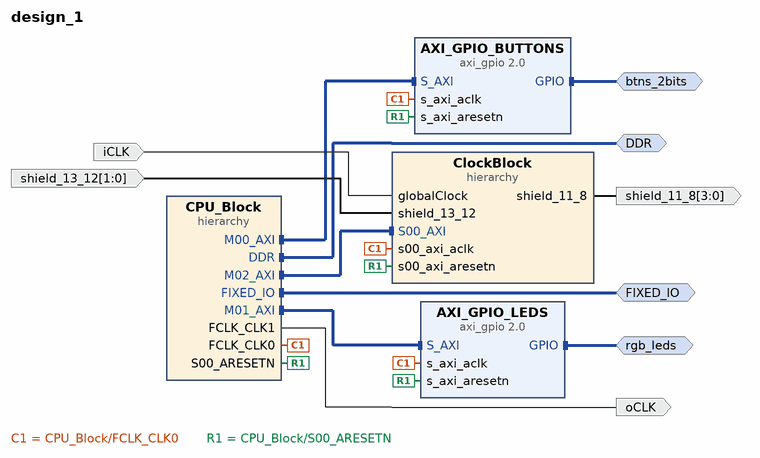
[diagram p0: block diagram of the top level]
# Vivado block design design_1, xc7z007sclg400-1, Vivado 2023.2
create_bd_design design_1

create_bd_intf_port -mode Master -vlnv xilinx.com:interface:ddrx_rtl:1.0 DDR
create_bd_intf_port -mode Master -vlnv xilinx.com:display_processing_system7:fixedio_rtl:1.0 FIXED_IO
create_bd_intf_port -mode Master -vlnv xilinx.com:interface:gpio_rtl:1.0 rgb_leds
create_bd_intf_port -mode Master -vlnv xilinx.com:interface:gpio_rtl:1.0 btns_2bits
create_bd_port -dir O -from 3 -to 0 shield_11_8
create_bd_port -dir I -from 1 -to 0 -type data shield_13_12
create_bd_port -dir I -type clk iCLK
set_property -dict {CONFIG.FREQ_HZ 100000000} [get_bd_ports iCLK]
create_bd_port -dir O -type clk oCLK

create_bd_cell -type ip -vlnv xilinx.com:ip:axi_gpio:2.0 AXI_GPIO_LEDS
set_property -dict {CONFIG.GPIO_BOARD_INTERFACE rgb_leds CONFIG.USE_BOARD_FLOW true} [get_bd_cells AXI_GPIO_LEDS]
create_bd_cell -type ip -vlnv xilinx.com:ip:axi_gpio:2.0 AXI_GPIO_BUTTONS
set_property -dict [list \
  CONFIG.C_INTERRUPT_PRESENT 1 \
  CONFIG.GPIO_BOARD_INTERFACE btns_2bits \
  CONFIG.USE_BOARD_FLOW true \
] [get_bd_cells AXI_GPIO_BUTTONS]
create_bd_cell -type hier ClockBlock
create_bd_cell -type hier CPU_Block

# ---- hierarchy /ClockBlock ----
current_bd_instance /ClockBlock
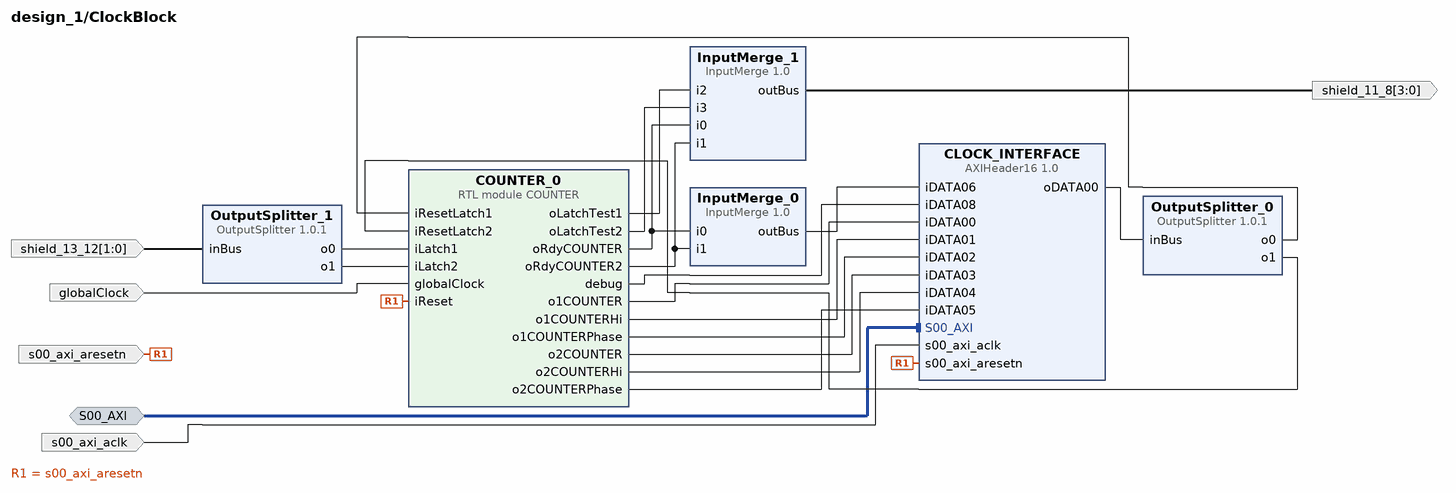
[diagram p1: block diagram inside /ClockBlock]
create_bd_intf_pin -mode Slave -vlnv xilinx.com:interface:aximm_rtl:1.0 S00_AXI
create_bd_pin -dir O -from 3 -to 0 shield_11_8
create_bd_pin -dir I -type clk s00_axi_aclk
create_bd_pin -dir I -type rst s00_axi_aresetn
create_bd_pin -dir I globalClock
create_bd_pin -dir I -from 1 -to 0 shield_13_12

create_bd_cell -type ip -vlnv d3x0r:user:AXIHeader16:1.0 CLOCK_INTERFACE
set_property -dict {CONFIG.INPUTS 9 CONFIG.OUTPUTS 1} [get_bd_cells CLOCK_INTERFACE]
create_bd_cell -type ip -vlnv d3x0r:user:OutputSplitter:1.0.1 OutputSplitter_1
set_property -dict {CONFIG.inWidth 2} [get_bd_cells OutputSplitter_1]
create_bd_cell -type ip -vlnv d3x0r:user:InputMerge:1.0 InputMerge_0
set_property -dict [list \
  CONFIG.inWidth4 0 \
  CONFIG.inWidth5 0 \
  CONFIG.inWidth6 0 \
  CONFIG.inWidth7 0 \
  CONFIG.inWidth8 0 \
  CONFIG.inWidth9 0 \
  CONFIG.inWidth10 0 \
  CONFIG.inWidth11 0 \
  CONFIG.inWidth12 0 \
  CONFIG.inWidth13 0 \
  CONFIG.inWidth14 0 \
  CONFIG.inWidth15 0 \
  CONFIG.inWidth16 0 \
  CONFIG.inWidth17 0 \
  CONFIG.inWidth18 0 \
  CONFIG.inWidth19 0 \
  CONFIG.inWidth20 0 \
  CONFIG.inWidth21 0 \
  CONFIG.inWidth22 0 \
  CONFIG.inWidth23 0 \
  CONFIG.inWidth24 0 \
  CONFIG.inWidth25 0 \
  CONFIG.inWidth26 0 \
  CONFIG.inWidth27 0 \
  CONFIG.inWidth28 0 \
  CONFIG.inWidth29 0 \
  CONFIG.inWidth30 0 \
  CONFIG.inWidth31 0 \
] [get_bd_cells InputMerge_0]
create_bd_cell -type module -reference COUNTER COUNTER_0
create_bd_cell -type ip -vlnv d3x0r:user:InputMerge:1.0 InputMerge_1
set_property -dict [list \
  CONFIG.inWidth4 0 \
  CONFIG.inWidth5 0 \
  CONFIG.inWidth6 0 \
  CONFIG.inWidth7 0 \
  CONFIG.inWidth8 0 \
  CONFIG.inWidth9 0 \
  CONFIG.inWidth10 0 \
  CONFIG.inWidth11 0 \
  CONFIG.inWidth12 0 \
  CONFIG.inWidth13 0 \
  CONFIG.inWidth14 0 \
  CONFIG.inWidth15 0 \
  CONFIG.inWidth16 0 \
  CONFIG.inWidth17 0 \
  CONFIG.inWidth18 0 \
  CONFIG.inWidth19 0 \
  CONFIG.inWidth20 0 \
  CONFIG.inWidth21 0 \
  CONFIG.inWidth22 0 \
  CONFIG.inWidth23 0 \
  CONFIG.inWidth24 0 \
  CONFIG.inWidth25 0 \
  CONFIG.inWidth26 0 \
  CONFIG.inWidth27 0 \
  CONFIG.inWidth28 0 \
  CONFIG.inWidth29 0 \
  CONFIG.inWidth30 0 \
  CONFIG.inWidth31 0 \
  CONFIG.outWidth 4 \
] [get_bd_cells InputMerge_1]
create_bd_cell -type ip -vlnv d3x0r:user:OutputSplitter:1.0.1 OutputSplitter_0
set_property -dict [list \
  CONFIG.enable02 false \
  CONFIG.enable03 false \
  CONFIG.enable04 false \
  CONFIG.enable05 false \
  CONFIG.enable06 false \
  CONFIG.enable07 false \
  CONFIG.enable08 false \
  CONFIG.enable09 false \
  CONFIG.enable10 false \
  CONFIG.enable11 false \
  CONFIG.enable12 false \
  CONFIG.enable13 false \
  CONFIG.enable14 false \
  CONFIG.enable15 false \
  CONFIG.enable16 false \
  CONFIG.enable17 false \
  CONFIG.enable18 false \
  CONFIG.enable19 false \
  CONFIG.enable20 false \
  CONFIG.enable21 false \
  CONFIG.enable22 false \
  CONFIG.enable23 false \
  CONFIG.enable24 false \
  CONFIG.enable25 false \
  CONFIG.enable26 false \
  CONFIG.enable27 false \
  CONFIG.enable28 false \
  CONFIG.enable29 false \
  CONFIG.enable30 false \
  CONFIG.enable31 false \
  CONFIG.inWidth 32 \
] [get_bd_cells OutputSplitter_0]

# ---- hierarchy /CPU_Block ----
current_bd_instance /CPU_Block
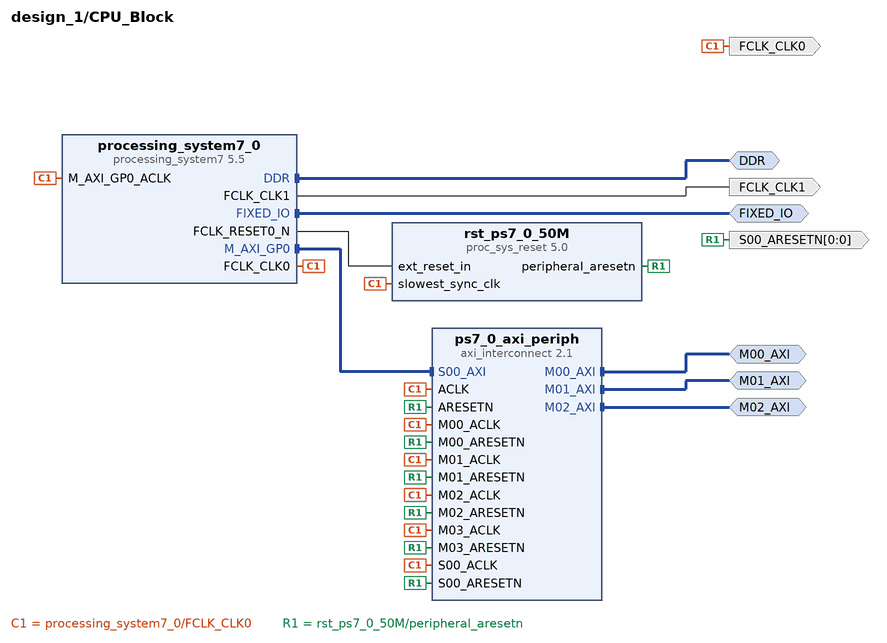
[diagram p2: block diagram inside /CPU_Block]
create_bd_intf_pin -mode Master -vlnv xilinx.com:interface:ddrx_rtl:1.0 DDR
create_bd_intf_pin -mode Master -vlnv xilinx.com:display_processing_system7:fixedio_rtl:1.0 FIXED_IO
create_bd_intf_pin -mode Master -vlnv xilinx.com:interface:aximm_rtl:1.0 M00_AXI
create_bd_intf_pin -mode Master -vlnv xilinx.com:interface:aximm_rtl:1.0 M01_AXI
create_bd_intf_pin -mode Master -vlnv xilinx.com:interface:aximm_rtl:1.0 M02_AXI
create_bd_pin -dir O -type clk FCLK_CLK0
create_bd_pin -dir O -type clk FCLK_CLK1
create_bd_pin -dir O -from 0 -to 0 -type rst S00_ARESETN

create_bd_cell -type ip -vlnv xilinx.com:ip:processing_system7:5.5 processing_system7_0
set_property -dict [list \
  CONFIG.PCW_APU_PERIPHERAL_FREQMHZ 650 \
  CONFIG.PCW_CRYSTAL_PERIPHERAL_FREQMHZ 50 \
  CONFIG.PCW_ENET0_ENET0_IO {MIO 16 .. 27} \
  CONFIG.PCW_ENET0_GRP_MDIO_ENABLE 1 \
  CONFIG.PCW_ENET0_GRP_MDIO_IO {MIO 52 .. 53} \
  CONFIG.PCW_ENET0_PERIPHERAL_ENABLE 1 \
  CONFIG.PCW_ENET0_RESET_ENABLE 1 \
  CONFIG.PCW_ENET0_RESET_IO {MIO 9} \
  CONFIG.PCW_ENET_RESET_ENABLE 1 \
  CONFIG.PCW_ENET_RESET_SELECT {Share reset pin} \
  CONFIG.PCW_EN_CLK1_PORT 1 \
  CONFIG.PCW_FCLK_CLK1_BUF TRUE \
  CONFIG.PCW_FPGA0_PERIPHERAL_FREQMHZ 50 \
  CONFIG.PCW_FPGA1_PERIPHERAL_FREQMHZ 250 \
  CONFIG.PCW_FPGA_FCLK1_ENABLE 1 \
  CONFIG.PCW_GPIO_MIO_GPIO_ENABLE 1 \
  CONFIG.PCW_GPIO_MIO_GPIO_IO MIO \
  CONFIG.PCW_I2C_RESET_ENABLE 1 \
  CONFIG.PCW_PERIPHERAL_BOARD_PRESET part0 \
  CONFIG.PCW_PRESET_BANK1_VOLTAGE {LVCMOS 1.8V} \
  CONFIG.PCW_QSPI_PERIPHERAL_ENABLE 0 \
  CONFIG.PCW_SD0_GRP_CD_ENABLE 1 \
  CONFIG.PCW_SD0_GRP_CD_IO {MIO 47} \
  CONFIG.PCW_SD0_GRP_WP_ENABLE 0 \
  CONFIG.PCW_SD0_PERIPHERAL_ENABLE 1 \
  CONFIG.PCW_SD0_SD0_IO {MIO 40 .. 45} \
  CONFIG.PCW_SDIO_PERIPHERAL_FREQMHZ 100 \
  CONFIG.PCW_UART0_PERIPHERAL_ENABLE 1 \
  CONFIG.PCW_UART0_UART0_IO {MIO 14 .. 15} \
  CONFIG.PCW_UART1_PERIPHERAL_ENABLE 0 \
  CONFIG.PCW_UART_PERIPHERAL_FREQMHZ 100 \
  CONFIG.PCW_UIPARAM_DDR_BUS_WIDTH {16 Bit} \
  CONFIG.PCW_UIPARAM_DDR_FREQ_MHZ 525 \
  CONFIG.PCW_UIPARAM_DDR_PARTNO {MT41K256M16 RE-125} \
  CONFIG.PCW_USB0_PERIPHERAL_ENABLE 1 \
  CONFIG.PCW_USB0_RESET_ENABLE 1 \
  CONFIG.PCW_USB0_RESET_IO {MIO 46} \
  CONFIG.PCW_USB0_USB0_IO {MIO 28 .. 39} \
  CONFIG.PCW_USB_RESET_ENABLE 1 \
  CONFIG.PCW_USB_RESET_SELECT {Share reset pin} \
  CONFIG.preset None \
] [get_bd_cells processing_system7_0]
# 495 more settings of processing_system7_0 are not shown: defaults, MIO pin electricals, DDR timing, and values the tool derives
create_bd_cell -type ip -vlnv xilinx.com:ip:proc_sys_reset:5.0 rst_ps7_0_50M
create_bd_cell -type ip -vlnv xilinx.com:ip:axi_interconnect:2.1 ps7_0_axi_periph
set_property -dict {CONFIG.NUM_MI 4} [get_bd_cells ps7_0_axi_periph]

# ---- connections ----

current_bd_instance /ClockBlock
connect_bd_intf_net [get_bd_intf_pins CLOCK_INTERFACE/S00_AXI] [get_bd_intf_pins S00_AXI]
connect_bd_net -net AXIHeader16_0_oDATA00 [get_bd_pins CLOCK_INTERFACE/oDATA00] [get_bd_pins OutputSplitter_0/inBus]
connect_bd_net [get_bd_pins COUNTER_0/debug] [get_bd_pins CLOCK_INTERFACE/iDATA08]
connect_bd_net [get_bd_pins COUNTER_0/o1COUNTER] [get_bd_pins CLOCK_INTERFACE/iDATA00]
connect_bd_net [get_bd_pins COUNTER_0/o1COUNTERHi] [get_bd_pins CLOCK_INTERFACE/iDATA01]
connect_bd_net [get_bd_pins COUNTER_0/o1COUNTERPhase] [get_bd_pins CLOCK_INTERFACE/iDATA02]
connect_bd_net [get_bd_pins COUNTER_0/o2COUNTER] [get_bd_pins CLOCK_INTERFACE/iDATA03]
connect_bd_net [get_bd_pins COUNTER_0/o2COUNTERHi] [get_bd_pins CLOCK_INTERFACE/iDATA04]
connect_bd_net [get_bd_pins COUNTER_0/o2COUNTERPhase] [get_bd_pins CLOCK_INTERFACE/iDATA05]
connect_bd_net [get_bd_pins COUNTER_0/oLatchTest1] [get_bd_pins InputMerge_1/i2]
connect_bd_net [get_bd_pins COUNTER_0/oLatchTest2] [get_bd_pins InputMerge_1/i3]
connect_bd_net [get_bd_pins COUNTER_0/oRdyCOUNTER] [get_bd_pins InputMerge_0/i0] [get_bd_pins InputMerge_1/i0]
connect_bd_net [get_bd_pins COUNTER_0/oRdyCOUNTER2] [get_bd_pins InputMerge_0/i1] [get_bd_pins InputMerge_1/i1]
connect_bd_net [get_bd_pins InputMerge_0/outBus] [get_bd_pins CLOCK_INTERFACE/iDATA06]
connect_bd_net [get_bd_pins InputMerge_1/outBus] [get_bd_pins shield_11_8]
connect_bd_net [get_bd_pins OutputSplitter_0/o0] [get_bd_pins COUNTER_0/iResetLatch1]
connect_bd_net [get_bd_pins OutputSplitter_0/o1] [get_bd_pins COUNTER_0/iResetLatch2]
connect_bd_net [get_bd_pins OutputSplitter_1/o0] [get_bd_pins COUNTER_0/iLatch1]
connect_bd_net [get_bd_pins OutputSplitter_1/o1] [get_bd_pins COUNTER_0/iLatch2]
connect_bd_net [get_bd_pins globalClock] [get_bd_pins COUNTER_0/globalClock]
connect_bd_net [get_bd_pins s00_axi_aclk] [get_bd_pins CLOCK_INTERFACE/s00_axi_aclk]
connect_bd_net [get_bd_pins s00_axi_aresetn] [get_bd_pins CLOCK_INTERFACE/s00_axi_aresetn] [get_bd_pins COUNTER_0/iReset]
connect_bd_net -net shield_13_12_1 [get_bd_pins shield_13_12] [get_bd_pins OutputSplitter_1/inBus]

current_bd_instance /CPU_Block
connect_bd_intf_net [get_bd_intf_pins DDR] [get_bd_intf_pins processing_system7_0/DDR]
connect_bd_intf_net [get_bd_intf_pins FIXED_IO] [get_bd_intf_pins processing_system7_0/FIXED_IO]
connect_bd_intf_net [get_bd_intf_pins processing_system7_0/M_AXI_GP0] [get_bd_intf_pins ps7_0_axi_periph/S00_AXI]
connect_bd_intf_net [get_bd_intf_pins M00_AXI] [get_bd_intf_pins ps7_0_axi_periph/M00_AXI]
connect_bd_intf_net [get_bd_intf_pins M01_AXI] [get_bd_intf_pins ps7_0_axi_periph/M01_AXI]
connect_bd_intf_net [get_bd_intf_pins M02_AXI] [get_bd_intf_pins ps7_0_axi_periph/M02_AXI]
connect_bd_net [get_bd_pins processing_system7_0/FCLK_CLK0] \
  [get_bd_pins FCLK_CLK0] [get_bd_pins ps7_0_axi_periph/S00_ACLK] [get_bd_pins rst_ps7_0_50M/slowest_sync_clk] \
  [get_bd_pins ps7_0_axi_periph/M00_ACLK] [get_bd_pins ps7_0_axi_periph/ACLK] [get_bd_pins ps7_0_axi_periph/M01_ACLK] \
  [get_bd_pins ps7_0_axi_periph/M02_ACLK] [get_bd_pins processing_system7_0/M_AXI_GP0_ACLK] \
  [get_bd_pins ps7_0_axi_periph/M03_ACLK]
connect_bd_net [get_bd_pins processing_system7_0/FCLK_CLK1] [get_bd_pins FCLK_CLK1]
connect_bd_net [get_bd_pins processing_system7_0/FCLK_RESET0_N] [get_bd_pins rst_ps7_0_50M/ext_reset_in]
connect_bd_net [get_bd_pins rst_ps7_0_50M/peripheral_aresetn] \
  [get_bd_pins S00_ARESETN] [get_bd_pins ps7_0_axi_periph/S00_ARESETN] [get_bd_pins ps7_0_axi_periph/M00_ARESETN] \
  [get_bd_pins ps7_0_axi_periph/ARESETN] [get_bd_pins ps7_0_axi_periph/M01_ARESETN] \
  [get_bd_pins ps7_0_axi_periph/M02_ARESETN] [get_bd_pins ps7_0_axi_periph/M03_ARESETN]

current_bd_instance /
connect_bd_intf_net [get_bd_intf_ports btns_2bits] [get_bd_intf_pins AXI_GPIO_BUTTONS/GPIO]
connect_bd_intf_net [get_bd_intf_pins CPU_Block/M00_AXI] [get_bd_intf_pins AXI_GPIO_BUTTONS/S_AXI]
connect_bd_intf_net [get_bd_intf_pins CPU_Block/M01_AXI] [get_bd_intf_pins AXI_GPIO_LEDS/S_AXI]
connect_bd_intf_net -intf_net axi_gpio_0_GPIO [get_bd_intf_ports rgb_leds] [get_bd_intf_pins AXI_GPIO_LEDS/GPIO]
connect_bd_intf_net -intf_net processing_system7_0_DDR [get_bd_intf_ports DDR] [get_bd_intf_pins CPU_Block/DDR]
connect_bd_intf_net -intf_net processing_system7_0_FIXED_IO [get_bd_intf_ports FIXED_IO] [get_bd_intf_pins CPU_Block/FIXED_IO]
connect_bd_intf_net [get_bd_intf_pins CPU_Block/M02_AXI] [get_bd_intf_pins ClockBlock/S00_AXI]
connect_bd_net [get_bd_pins CPU_Block/FCLK_CLK1] [get_bd_ports oCLK]
connect_bd_net -net InputMerge_1_outBus [get_bd_pins ClockBlock/shield_11_8] [get_bd_ports shield_11_8]
connect_bd_net [get_bd_ports iCLK] [get_bd_pins ClockBlock/globalClock]
connect_bd_net -net processing_system7_0_FCLK_CLK0 [get_bd_pins CPU_Block/FCLK_CLK0] \
  [get_bd_pins AXI_GPIO_LEDS/s_axi_aclk] [get_bd_pins AXI_GPIO_BUTTONS/s_axi_aclk] [get_bd_pins ClockBlock/s00_axi_aclk]
connect_bd_net -net rst_ps7_0_50M_peripheral_aresetn [get_bd_pins CPU_Block/S00_ARESETN] \
  [get_bd_pins AXI_GPIO_LEDS/s_axi_aresetn] [get_bd_pins AXI_GPIO_BUTTONS/s_axi_aresetn] \
  [get_bd_pins ClockBlock/s00_axi_aresetn]
connect_bd_net -net shield_13_12_1 [get_bd_ports shield_13_12] [get_bd_pins ClockBlock/shield_13_12]

# ---- address map ----
assign_bd_address -offset 0x41200000 -range 64K -target_address_space [get_bd_addr_spaces CPU_Block/processing_system7_0/Data] [get_bd_addr_segs AXI_GPIO_BUTTONS/S_AXI/Reg]
assign_bd_address -offset 0x41210000 -range 64K -target_address_space [get_bd_addr_spaces CPU_Block/processing_system7_0/Data] [get_bd_addr_segs AXI_GPIO_LEDS/S_AXI/Reg]
assign_bd_address -offset 0x43C00000 -range 512 -target_address_space [get_bd_addr_spaces CPU_Block/processing_system7_0/Data] [get_bd_addr_segs ClockBlock/CLOCK_INTERFACE/S00_AXI/S00_AXI_reg]

validate_bd_design
save_bd_design
